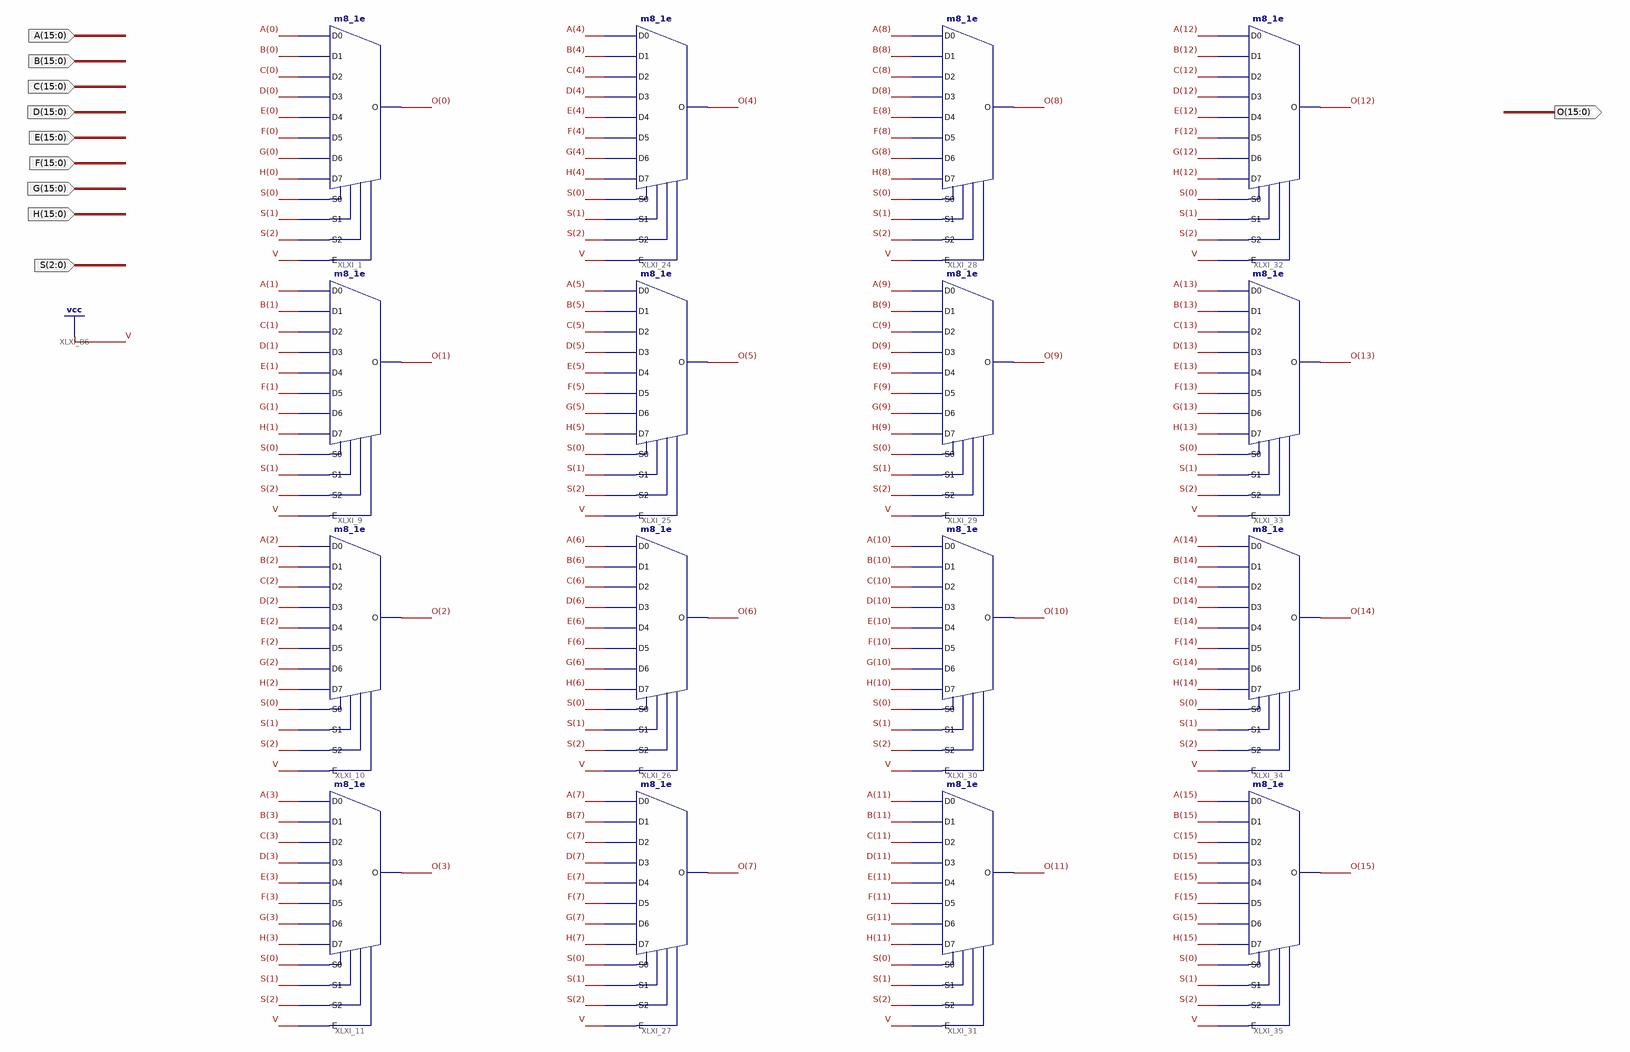
[diagram p0: schematic sheet 1]
// Xilinx ISE schematic mux16b8.sch (spartan3e) as structural Verilog: 16 symbols, 10 ports
module mux16b8 (
  input  [15:0] A,
  input  [15:0] B,
  input  [15:0] C,
  input  [15:0] D,
  input  [15:0] E,
  input  [15:0] F,
  input  [15:0] G,
  input  [15:0] H,
  input  [2:0] S,
  output [15:0] O
);

  m8_1e XLXI_1 (
    .D0(A[0]), .D1(B[0]), .D2(C[0]), .D3(D[0]), .D4(E[0]), .D5(F[0]), .D6(G[0]), .D7(H[0]), .E(1'b1),
    .S0(S[0]), .S1(S[1]), .S2(S[2]), .O(O[0]));
  m8_1e XLXI_9 (
    .D0(A[1]), .D1(B[1]), .D2(C[1]), .D3(D[1]), .D4(E[1]), .D5(F[1]), .D6(G[1]), .D7(H[1]), .E(1'b1),
    .S0(S[0]), .S1(S[1]), .S2(S[2]), .O(O[1]));
  m8_1e XLXI_10 (
    .D0(A[2]), .D1(B[2]), .D2(C[2]), .D3(D[2]), .D4(E[2]), .D5(F[2]), .D6(G[2]), .D7(H[2]), .E(1'b1),
    .S0(S[0]), .S1(S[1]), .S2(S[2]), .O(O[2]));
  m8_1e XLXI_11 (
    .D0(A[3]), .D1(B[3]), .D2(C[3]), .D3(D[3]), .D4(E[3]), .D5(F[3]), .D6(G[3]), .D7(H[3]), .E(1'b1),
    .S0(S[0]), .S1(S[1]), .S2(S[2]), .O(O[3]));
  m8_1e XLXI_24 (
    .D0(A[4]), .D1(B[4]), .D2(C[4]), .D3(D[4]), .D4(E[4]), .D5(F[4]), .D6(G[4]), .D7(H[4]), .E(1'b1),
    .S0(S[0]), .S1(S[1]), .S2(S[2]), .O(O[4]));
  m8_1e XLXI_25 (
    .D0(A[5]), .D1(B[5]), .D2(C[5]), .D3(D[5]), .D4(E[5]), .D5(F[5]), .D6(G[5]), .D7(H[5]), .E(1'b1),
    .S0(S[0]), .S1(S[1]), .S2(S[2]), .O(O[5]));
  m8_1e XLXI_26 (
    .D0(A[6]), .D1(B[6]), .D2(C[6]), .D3(D[6]), .D4(E[6]), .D5(F[6]), .D6(G[6]), .D7(H[6]), .E(1'b1),
    .S0(S[0]), .S1(S[1]), .S2(S[2]), .O(O[6]));
  m8_1e XLXI_27 (
    .D0(A[7]), .D1(B[7]), .D2(C[7]), .D3(D[7]), .D4(E[7]), .D5(F[7]), .D6(G[7]), .D7(H[7]), .E(1'b1),
    .S0(S[0]), .S1(S[1]), .S2(S[2]), .O(O[7]));
  m8_1e XLXI_28 (
    .D0(A[8]), .D1(B[8]), .D2(C[8]), .D3(D[8]), .D4(E[8]), .D5(F[8]), .D6(G[8]), .D7(H[8]), .E(1'b1),
    .S0(S[0]), .S1(S[1]), .S2(S[2]), .O(O[8]));
  m8_1e XLXI_29 (
    .D0(A[9]), .D1(B[9]), .D2(C[9]), .D3(D[9]), .D4(E[9]), .D5(F[9]), .D6(G[9]), .D7(H[9]), .E(1'b1),
    .S0(S[0]), .S1(S[1]), .S2(S[2]), .O(O[9]));
  m8_1e XLXI_30 (
    .D0(A[10]), .D1(B[10]), .D2(C[10]), .D3(D[10]), .D4(E[10]), .D5(F[10]), .D6(G[10]), .D7(H[10]), .E(1'b1),
    .S0(S[0]), .S1(S[1]), .S2(S[2]), .O(O[10]));
  m8_1e XLXI_31 (
    .D0(A[11]), .D1(B[11]), .D2(C[11]), .D3(D[11]), .D4(E[11]), .D5(F[11]), .D6(G[11]), .D7(H[11]), .E(1'b1),
    .S0(S[0]), .S1(S[1]), .S2(S[2]), .O(O[11]));
  m8_1e XLXI_32 (
    .D0(A[12]), .D1(B[12]), .D2(C[12]), .D3(D[12]), .D4(E[12]), .D5(F[12]), .D6(G[12]), .D7(H[12]), .E(1'b1),
    .S0(S[0]), .S1(S[1]), .S2(S[2]), .O(O[12]));
  m8_1e XLXI_33 (
    .D0(A[13]), .D1(B[13]), .D2(C[13]), .D3(D[13]), .D4(E[13]), .D5(F[13]), .D6(G[13]), .D7(H[13]), .E(1'b1),
    .S0(S[0]), .S1(S[1]), .S2(S[2]), .O(O[13]));
  m8_1e XLXI_34 (
    .D0(A[14]), .D1(B[14]), .D2(C[14]), .D3(D[14]), .D4(E[14]), .D5(F[14]), .D6(G[14]), .D7(H[14]), .E(1'b1),
    .S0(S[0]), .S1(S[1]), .S2(S[2]), .O(O[14]));
  m8_1e XLXI_35 (
    .D0(A[15]), .D1(B[15]), .D2(C[15]), .D3(D[15]), .D4(E[15]), .D5(F[15]), .D6(G[15]), .D7(H[15]), .E(1'b1),
    .S0(S[0]), .S1(S[1]), .S2(S[2]), .O(O[15]));
endmodule
